# EAGLE schematic Badge (EAGLE 9.4.2)

## Sheet 1 of 8
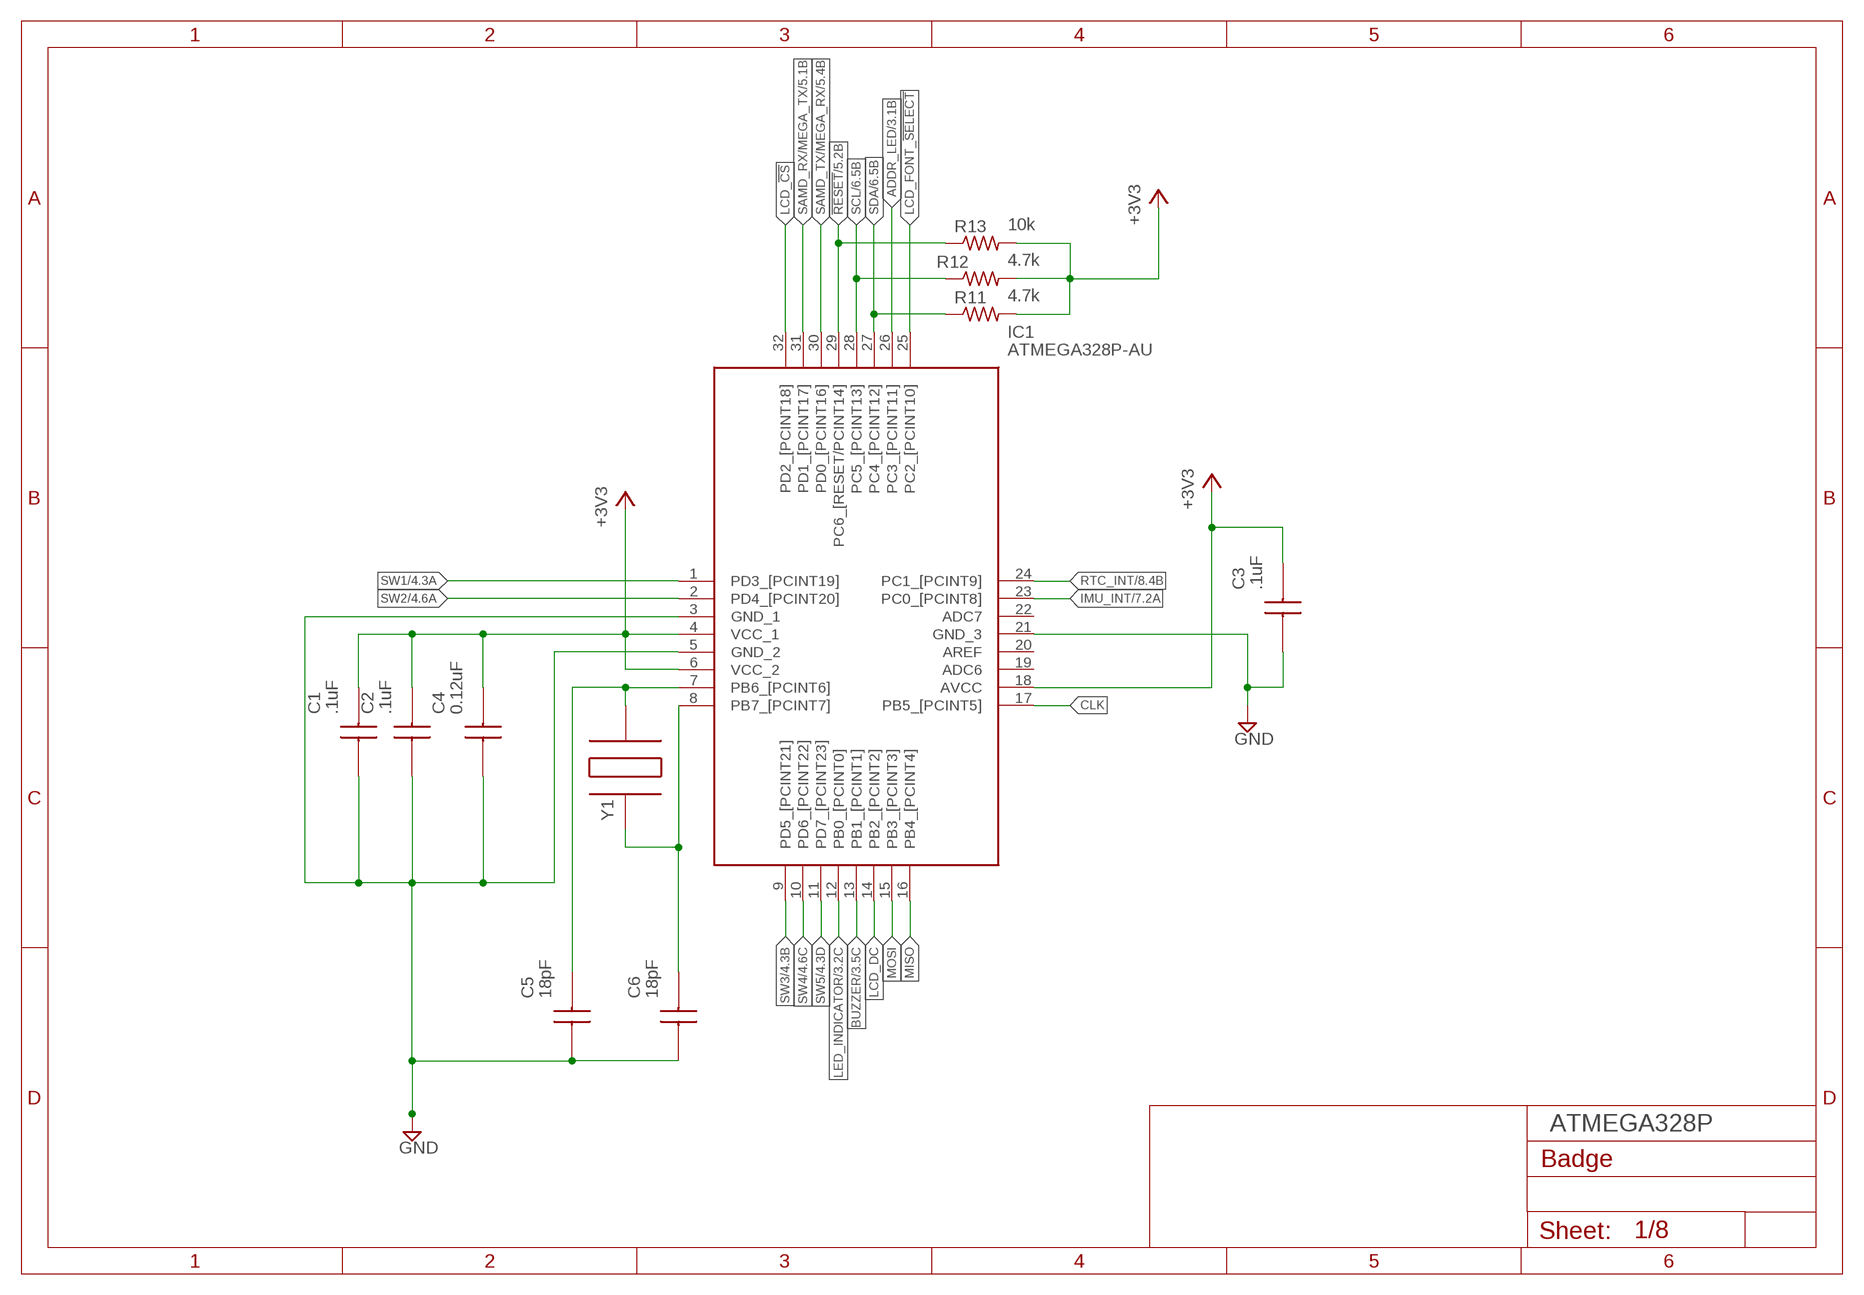
[diagram p0: schematic, sheet 1]

### Parts
C1  .1uF  C06030.1UF  [CAPC1608X87N]
C2  .1uF  C06030.1UF  [CAPC1608X87N]
C3  .1uF  C06030.1UF  [CAPC1608X87N]
C4  0.12uF  C0805  [CAPC2013X94N]
C5  18pF  C0603  [CAPC1608X87N]
C6  18pF  C0603  [CAPC1608X87N]
IC1  ATMEGA328P-AU  [QFP80P900X900X120-32N]
R11  4.7k  R-US_R0603  [R0603]
R12  4.7k  R-US_R0603  [R0603]
R13  10k  R-US_R0603  [R0603]
Y1  ABM3-16.000MHZ-B2-T  [ABM-3]

### Nets
!RESET!: IC1.29(PC6_[RESET/PCINT14]) R13.1 ; also sheet 5
+3V3: C1.2 C2.2 C3.2 C4.2(C2) IC1.4(VCC_1) IC1.6(VCC_2) IC1.18(AVCC) R11.2 R12.2 R13.2 ; also sheet 2,4,5,6,7,8
ADDR_LED: IC1.26(PC3_[PCINT11]) ; also sheet 3
BUZZER: IC1.13(PB1_[PCINT1]) ; also sheet 3
CLK: IC1.17(PB5_[PCINT5])
GND: C1.1 C2.1 C3.1 C4.1(C1) C5.1 C6.1 IC1.3(GND_1) IC1.5(GND_2) IC1.21(GND_3) ; also sheet 2,3,4,5,6,7,8
IMU_INT: IC1.23(PC0_[PCINT8]) ; also sheet 7
LCD_!CS!: IC1.32(PD2_[PCINT18])
LCD_DC: IC1.14(PB2_[PCINT2])
LCD_FONT_!SELECT!: IC1.25(PC2_[PCINT10])
LED_INDICATOR: IC1.12(PB0_[PCINT0]) ; also sheet 3
MISO: IC1.16(PB4_[PCINT4])
MOSI: IC1.15(PB3_[PCINT3])
N$1: C5.2 IC1.7(PB6_[PCINT6]) Y1.2
N$2: C6.2 IC1.8(PB7_[PCINT7]) Y1.1
RTC_INT: IC1.24(PC1_[PCINT9]) ; also sheet 8
SAMD_RX/MEGA_TX: IC1.31(PD1_[PCINT17]) ; also sheet 5
SAMD_TX/MEGA_RX: IC1.30(PD0_[PCINT16]) ; also sheet 5
SCL: IC1.28(PC5_[PCINT13]) R12.1 ; also sheet 6,7,8
SDA: IC1.27(PC4_[PCINT12]) R11.1 ; also sheet 6,7,8
SW1: IC1.1(PD3_[PCINT19]) ; also sheet 4
SW2: IC1.2(PD4_[PCINT20]) ; also sheet 4
SW3: IC1.9(PD5_[PCINT21]) ; also sheet 4
SW4: IC1.10(PD6_[PCINT22]) ; also sheet 4
SW5: IC1.11(PD7_[PCINT23]) ; also sheet 4
Unconnected: IC1.19(ADC6) IC1.20(AREF) IC1.22(ADC7)

### Notes on the sheet
- ATMEGA328P

## Sheet 2 of 8
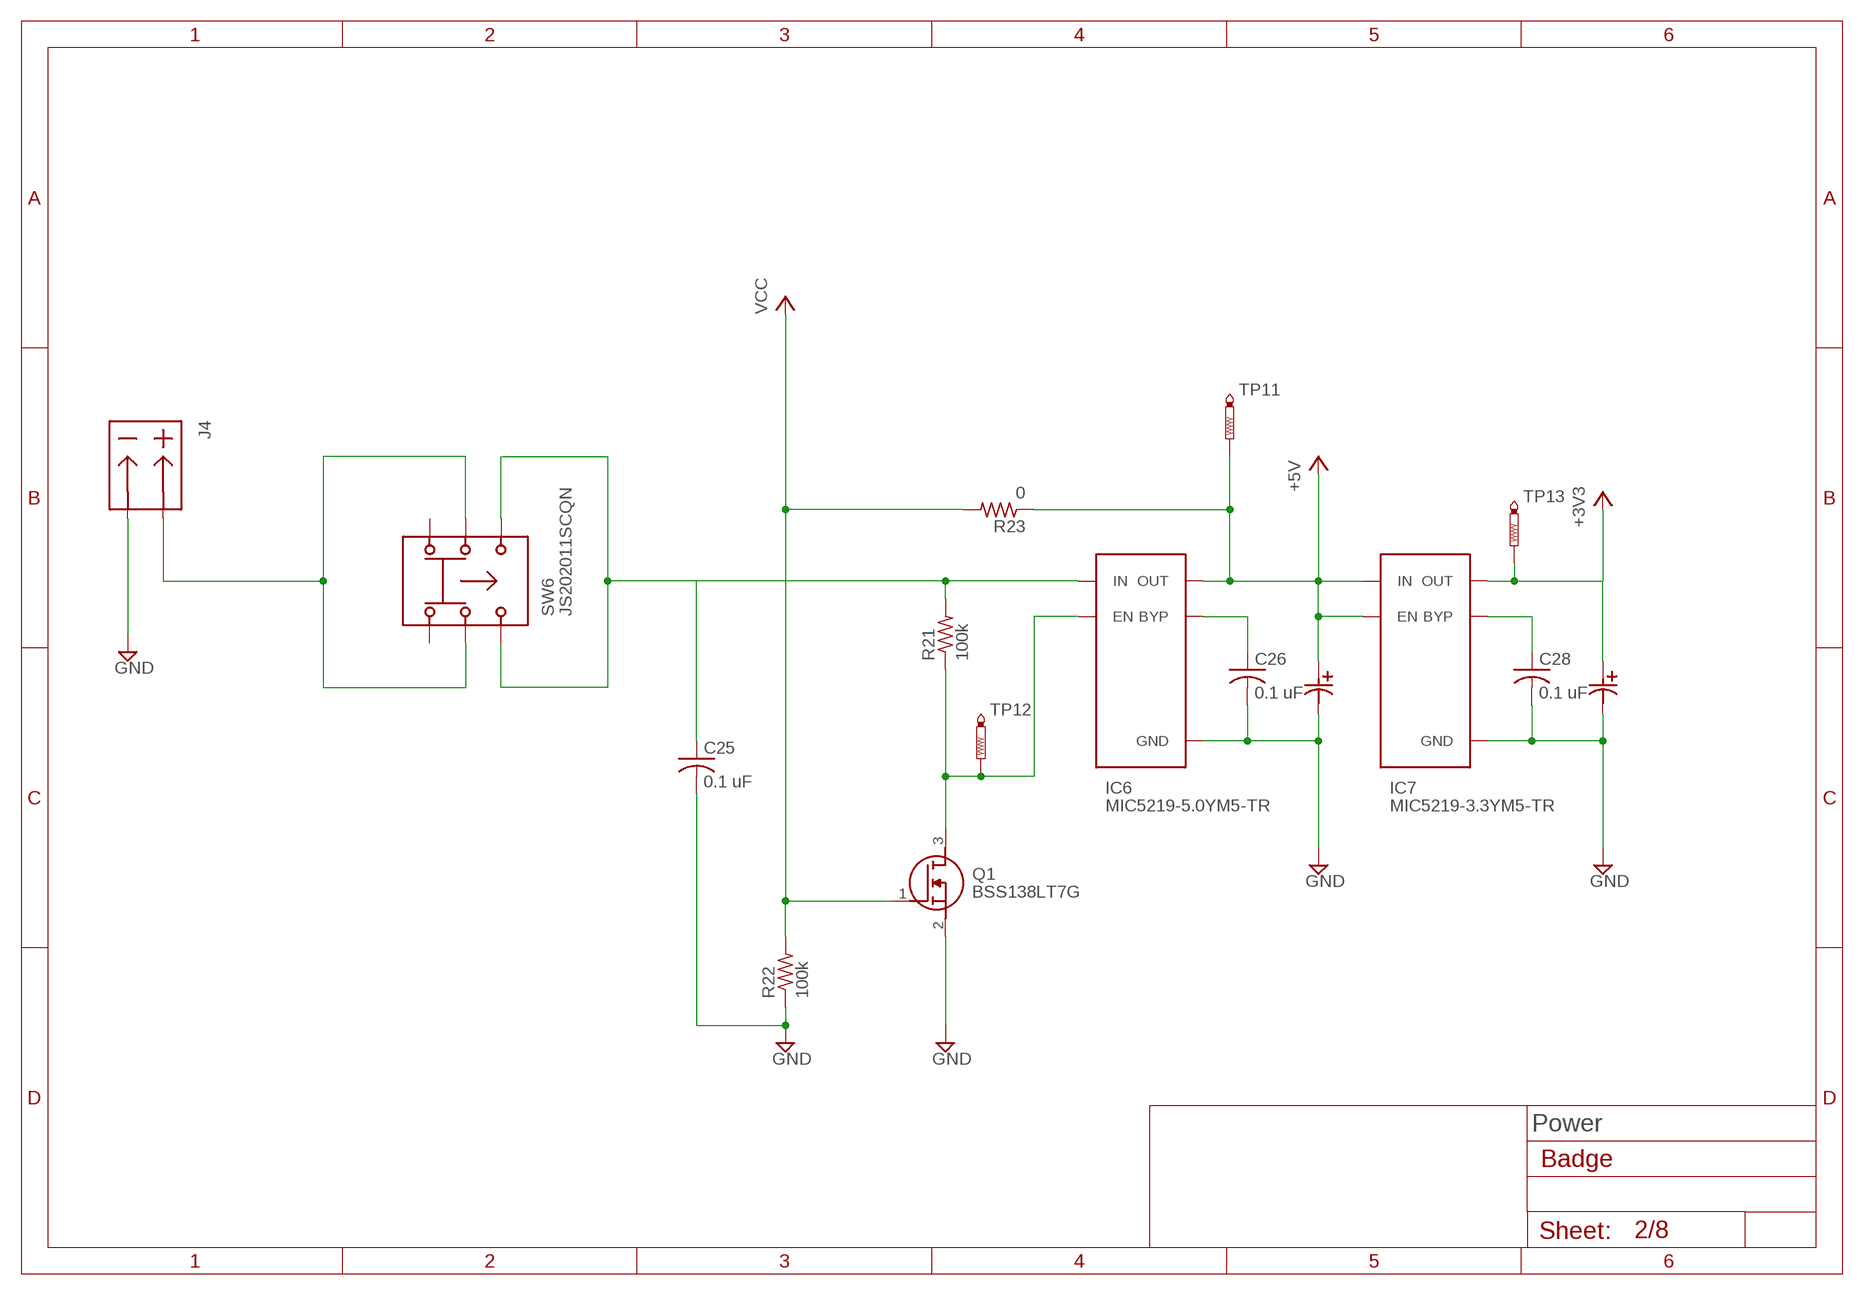
[diagram p1: schematic, sheet 2]

### Parts
C25  0.1 uF  C-USC0603K  [C0603K]
C26  0.1 uF  C-USC0603K  [C0603K]
C27  22uF 16V 4.3mm  22_UF_16V_4.3MM  [CAPAE430X550L180X65N]
C28  0.1 uF  C-USC0603K  [C0603K]
C29  22uF 16V 4.3mm  22_UF_16V_4.3MM  [CAPAE430X550L180X65N]
IC6  MIC5219-5.0YM5-TR  [SOT23-5P95_280X145L45X37N]
IC7  MIC5219-3.3YM5-TR  [SOT23-5P95_280X145L45X37N]
J4  DNP  BAT_CONNECTOR  [BATIN]
Q1  BSS138LT7G  [SOT96P237X111-3N]
R21  100k  R-US_R0603  [R0603]
R22  100k  R-US_R0603  [R0603]
R23  0  R-US_R0603  [R0603]
SW6  JS202011SCQN  [JS202011SCQN]
TP11  PTR1PAD1-20  [P1-20]
TP12  PTR1PAD1-20  [P1-20]
TP13  PTR1PAD1-20  [P1-20]

### Nets
+5V: C27.1(PLUS) IC6.5(OUT) IC7.1(IN) IC7.3(EN) R23.1 TP11.TP ; also sheet 3
+5V1: C29.1(PLUS) IC7.5(OUT) TP13.TP
GND: C25.2 C26.2 C27.2(MINUS) C28.2 C29.2(MINUS) IC6.2(GND) IC7.2(GND) J4.2 Q1.2(S) R22.1 ; also sheet 1,3,4,5,6,7,8
N$5: C26.1 IC6.4(BYP)
N$11: C28.1 IC7.4(BYP)
N$18: J4.1 SW6.2 SW6.5
N$27: C25.1 IC6.1(IN) R21.2 SW6.3 SW6.6
N$28: IC6.3(EN) Q1.3(D) R21.1 TP12.TP
VCC: Q1.1(G) R22.2 R23.2
Unconnected: SW6.1 SW6.4

### Notes on the sheet
- Power

## Sheet 3 of 8
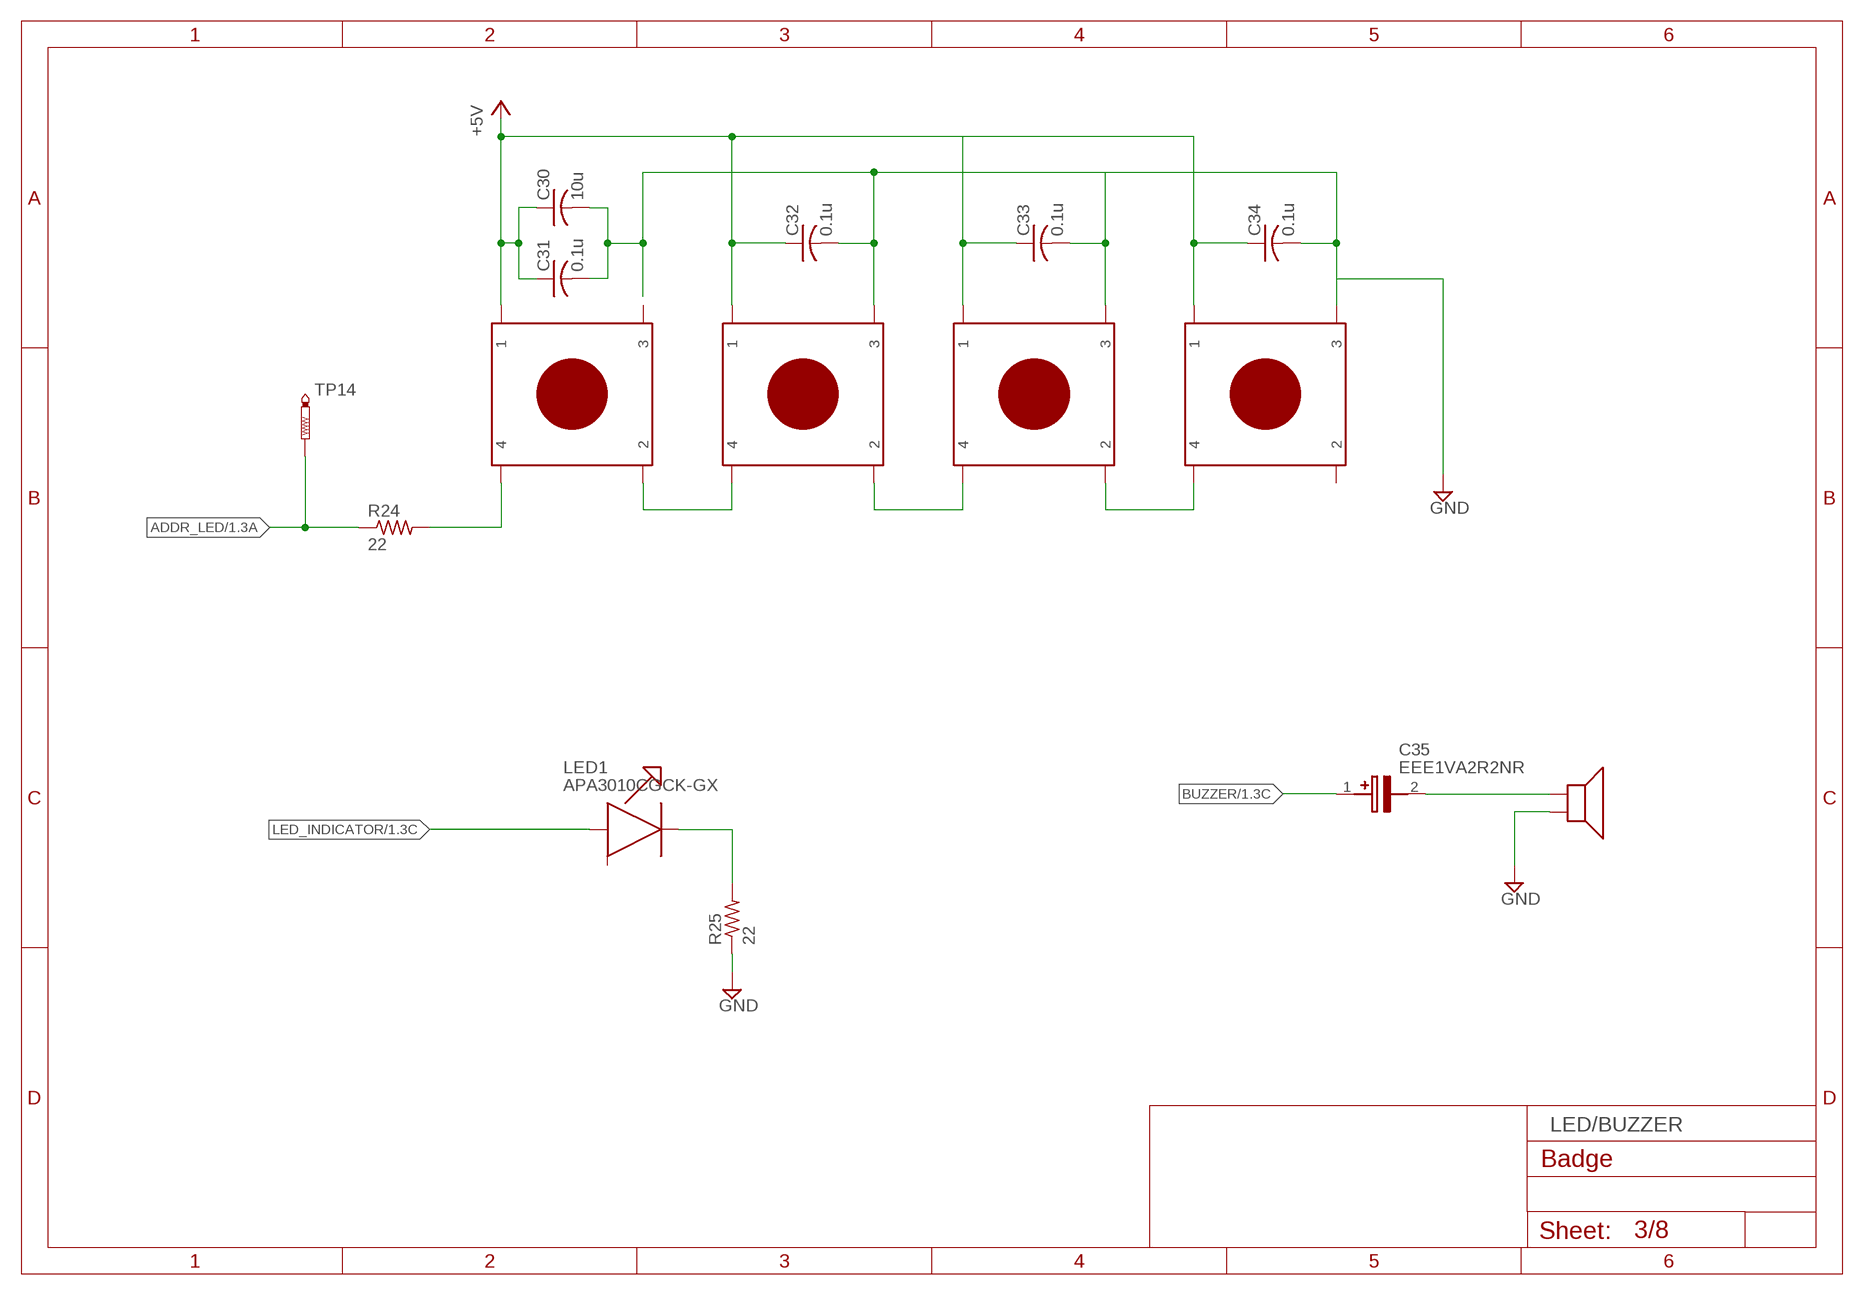
[diagram p2: schematic, sheet 3]

### Parts
C30  10u  C-USC0805K  [C0805K]
C31  0.1u  C-USC0603K  [C0603K]
C32  0.1u  C-USC0603K  [C0603K]
C33  0.1u  C-USC0603K  [C0603K]
C34  0.1u  C-USC0603K  [C0603K]
C35  EEE1VA2R2NR  [CAPAE430X550N]
D2  WS2812B  [WS2812B]
D3  WS2812B  [WS2812B]
D4  WS2812B  [WS2812B]
D5  WS2812B  [WS2812B]
LED1  APA3010CGCK-GX  [APA3010ZGCGX]
LS1  AST-03008MR-R  [PUIAUDIO_AST-03008MR-R]
R24  22  R-US_R0603  [R0603]
R25  22  R-US_R0603  [R0603]
TP14  PTR1PAD1-20  [P1-20]

### Nets
+5V: C30.1 C31.1 C32.1 C33.1 C34.1 D2.1 D3.1 D4.1 D5.1 ; also sheet 2
ADDR_LED: R24.1 TP14.TP ; also sheet 1
BUZZER: C35.1(+) ; also sheet 1
GND: C30.2 C31.2 C32.2 C33.2 C34.2 D3.3 D4.3 D5.3 LS1.2 R25.1 ; also sheet 1,2,4,5,6,7,8
LED_INDICATOR: LED1.2(A) ; also sheet 1
N$10: C35.2(-) LS1.1
N$12: LED1.1(K) R25.2
N$15: D2.2 D3.4
N$25: D3.2 D4.4
N$26: D4.2 D5.4
N$29: D2.4 R24.2
Unconnected: D2.3 D5.2 LED1.3(THERMAL_PAD)

### Notes on the sheet
- LED/BUZZER

## Sheet 4 of 8
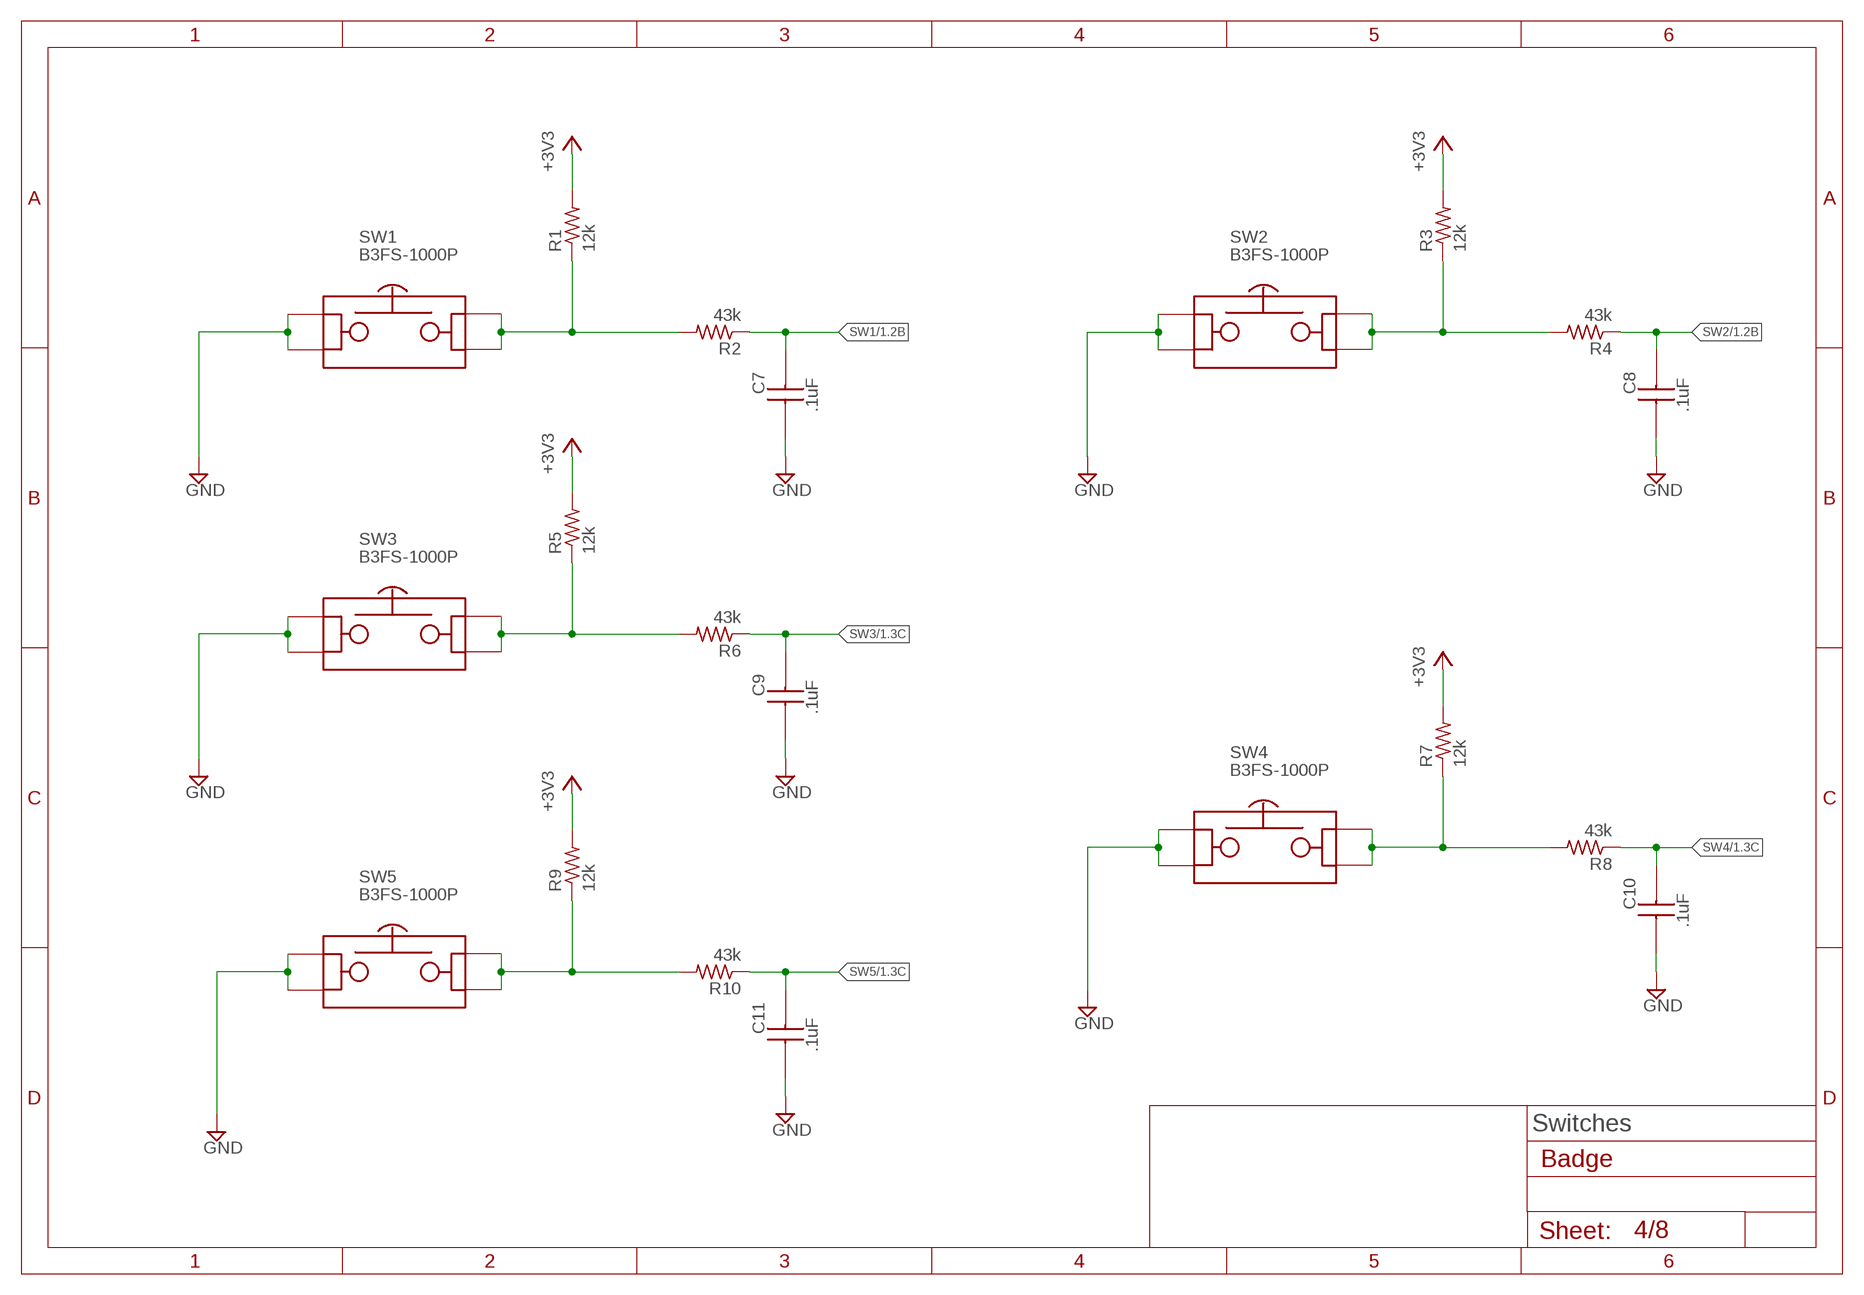
[diagram p3: schematic, sheet 4]

### Parts
C7  .1uF  C06030.1UF  [CAPC1608X87N]
C8  .1uF  C06030.1UF  [CAPC1608X87N]
C9  .1uF  C06030.1UF  [CAPC1608X87N]
C10  .1uF  C06030.1UF  [CAPC1608X87N]
C11  .1uF  C06030.1UF  [CAPC1608X87N]
R1  12k  R-US_R0603  [R0603]
R2  43k  R-US_R0603  [R0603]
R3  12k  R-US_R0603  [R0603]
R4  43k  R-US_R0603  [R0603]
R5  12k  R-US_R0603  [R0603]
R6  43k  R-US_R0603  [R0603]
R7  12k  R-US_R0603  [R0603]
R8  43k  R-US_R0603  [R0603]
R9  12k  R-US_R0603  [R0603]
R10  43k  R-US_R0603  [R0603]
SW1  B3FS-1000P  [B3FS-1000P]
SW2  B3FS-1000P  [B3FS-1000P]
SW3  B3FS-1000P  [B3FS-1000P]
SW4  B3FS-1000P  [B3FS-1000P]
SW5  B3FS-1000P  [B3FS-1000P]

### Nets
+3V3: R1.2 R3.2 R5.2 R7.2 R9.2 ; also sheet 1,2,5,6,7,8
GND: C7.1 C8.1 C9.1 C10.1 C11.1 SW1.P$1 SW1.P$2 SW2.P$1 SW2.P$2 SW3.P$1 SW3.P$2 SW4.P$1 SW4.P$2 SW5.P$1 SW5.P$2 ; also sheet 1,2,3,5,6,7,8
N$4: R1.1 R2.2 SW1.P$3 SW1.P$4
N$6: R5.1 R6.2 SW3.P$3 SW3.P$4
N$7: R7.1 R8.2 SW4.P$3 SW4.P$4
N$8: R3.1 R4.2 SW2.P$3 SW2.P$4
N$14: R9.1 R10.2 SW5.P$3 SW5.P$4
SW1: C7.2 R2.1 ; also sheet 1
SW2: C8.2 R4.1 ; also sheet 1
SW3: C9.2 R6.1 ; also sheet 1
SW4: C10.2 R8.1 ; also sheet 1
SW5: C11.2 R10.1 ; also sheet 1

### Notes on the sheet
- Switches

## Sheet 5 of 8
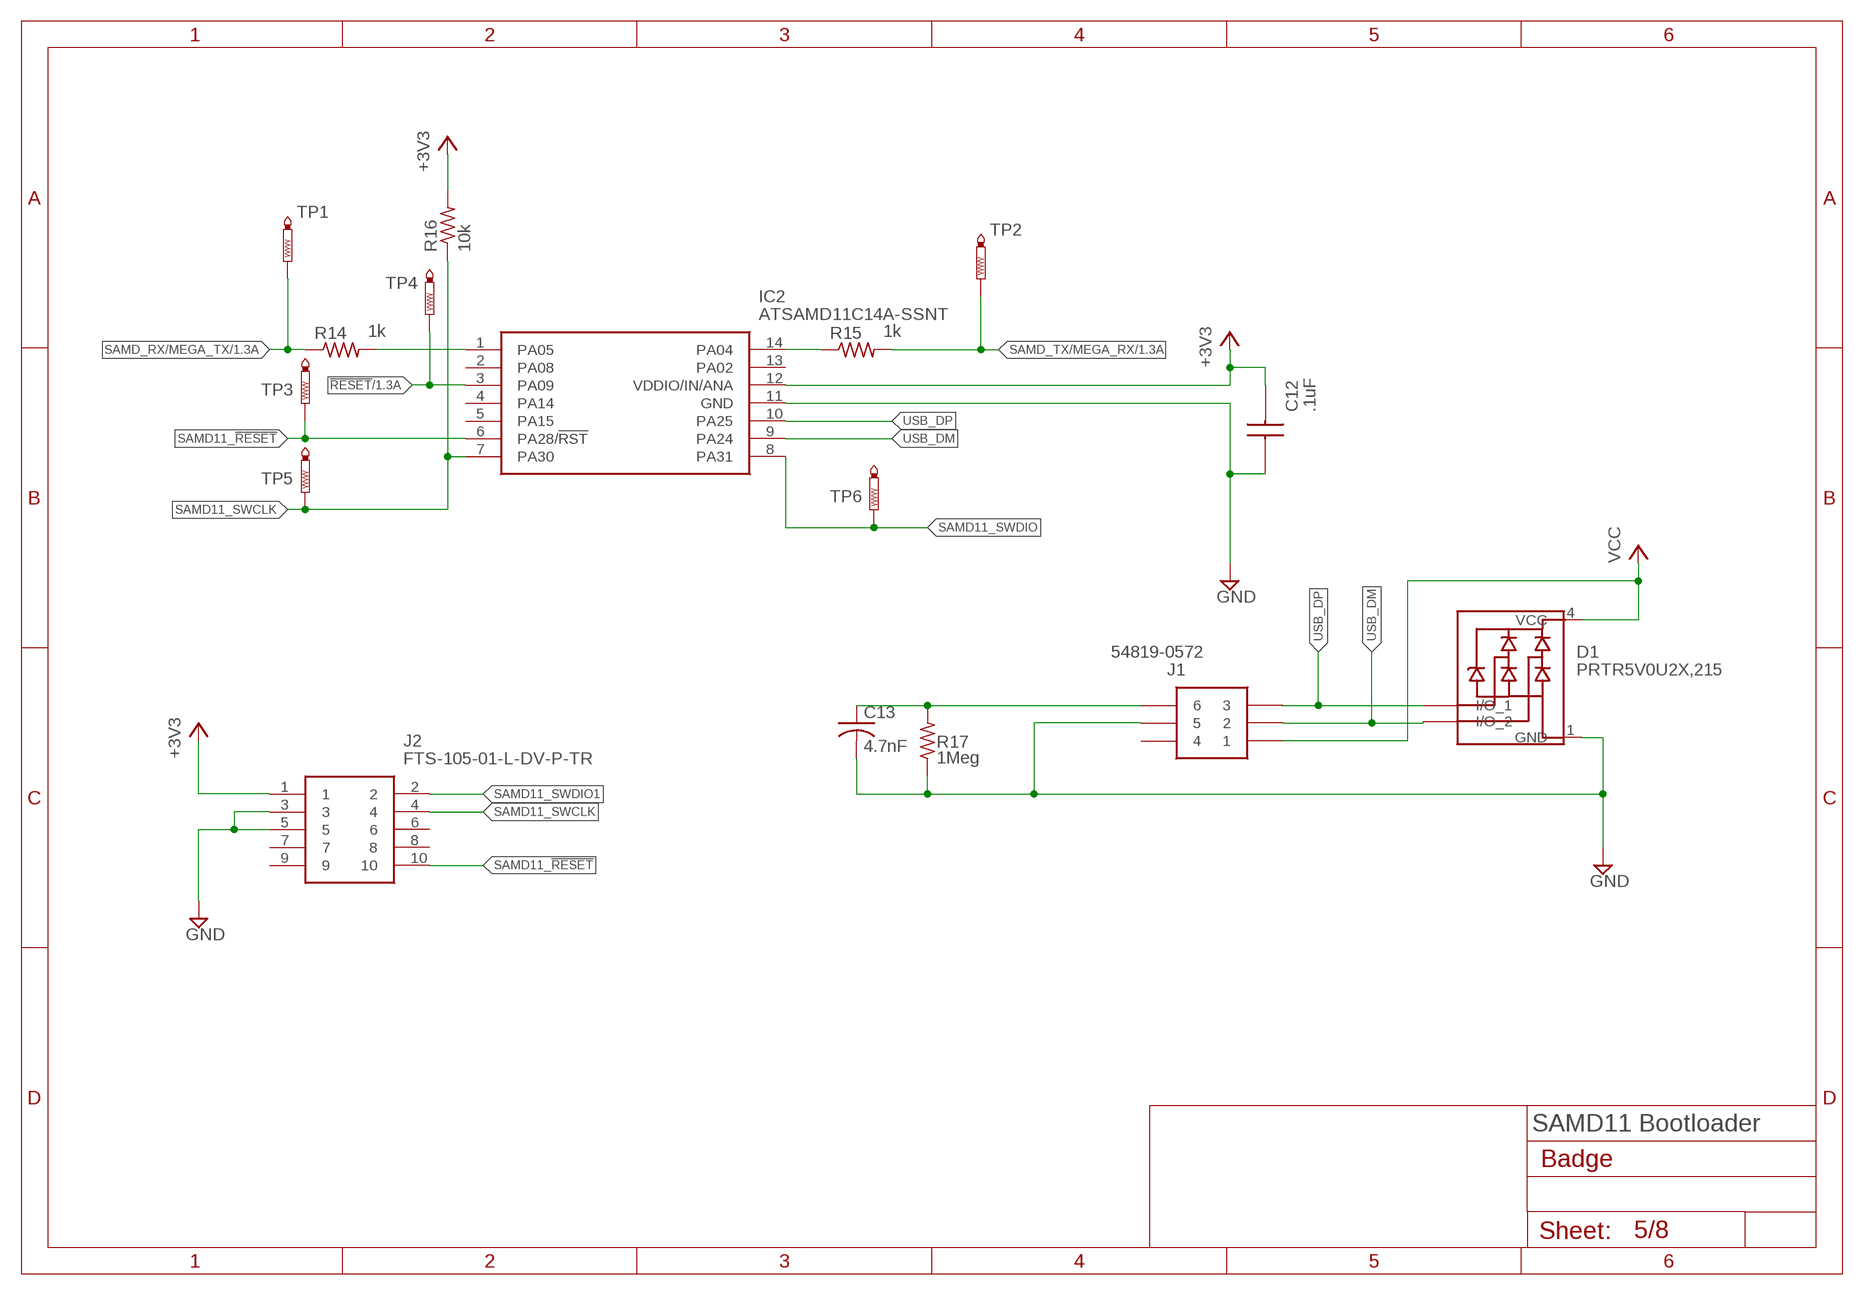
[diagram p4: schematic, sheet 5]

### Parts
C12  .1uF  C06030.1UF  [CAPC1608X87N]
C13  4.7nF  C-USC0805K  [C0805K]
D1  PRTR5V0U2X,215  [SOT-143B]
IC2  ATSAMD11C14A-SSNT  [SOIC127P600X175-14N]
J1  54819-0572  [MOLEXMINIBTYPEB_1]
J2  FTS-105-01-L-DV-P-TR  [FTS10501LDVPTR]
R14  1k  R-US_R0603  [R0603]
R15  1k  R-US_R0603  [R0603]
R16  10k  R-US_R0603  [R0603]
R17  1Meg  R-US_R0603  [R0603]
TP1  PTR1PAD1-20  [P1-20]
TP2  PTR1PAD1-20  [P1-20]
TP3  PTR1PAD1-20  [P1-20]
TP4  PTR1PAD1-20  [P1-20]
TP5  PTR1PAD1-20  [P1-20]
TP6  PTR1PAD1-20  [P1-20]

### Nets
!RESET!: IC2.3(PA09) TP4.TP ; also sheet 1
+3V3: C12.2 IC2.12(VDDIO/IN/ANA) J2.1 R16.2 ; also sheet 1,2,4,6,7,8
GND: C12.1 C13.2 D1.1(GND) IC2.11(GND) J1.5 J2.3 J2.5 R17.1 ; also sheet 1,2,3,4,6,7,8
N$3: IC2.14(PA04) R15.1
N$9: IC2.1(PA05) R14.2
N$13: C13.1 J1.6 J1.7 J1.8 J1.9 R17.2
SAMD11_!RESET!: IC2.6(PA28/!RST) J2.10 TP3.TP
SAMD11_SWCLK: IC2.7(PA30) J2.4 R16.1 TP5.TP
SAMD11_SWDIO: IC2.8(PA31) TP6.TP
SAMD11_SWDIO1: J2.2
SAMD_RX/MEGA_TX: R14.1 TP1.TP ; also sheet 1
SAMD_TX/MEGA_RX: R15.2 TP2.TP ; also sheet 1
USB_DM: D1.3(I/O_2) IC2.9(PA24) J1.2
USB_DP: D1.2(I/O_1) IC2.10(PA25) J1.3
V_USB: D1.4(VCC) J1.1 ; supply symbol labelled VCC
Unconnected: IC2.2(PA08) IC2.4(PA14) IC2.5(PA15) IC2.13(PA02) J1.4 J2.6 J2.7 J2.8 J2.9

### Notes on the sheet
- SAMD11 Bootloader

## Sheet 6 of 8
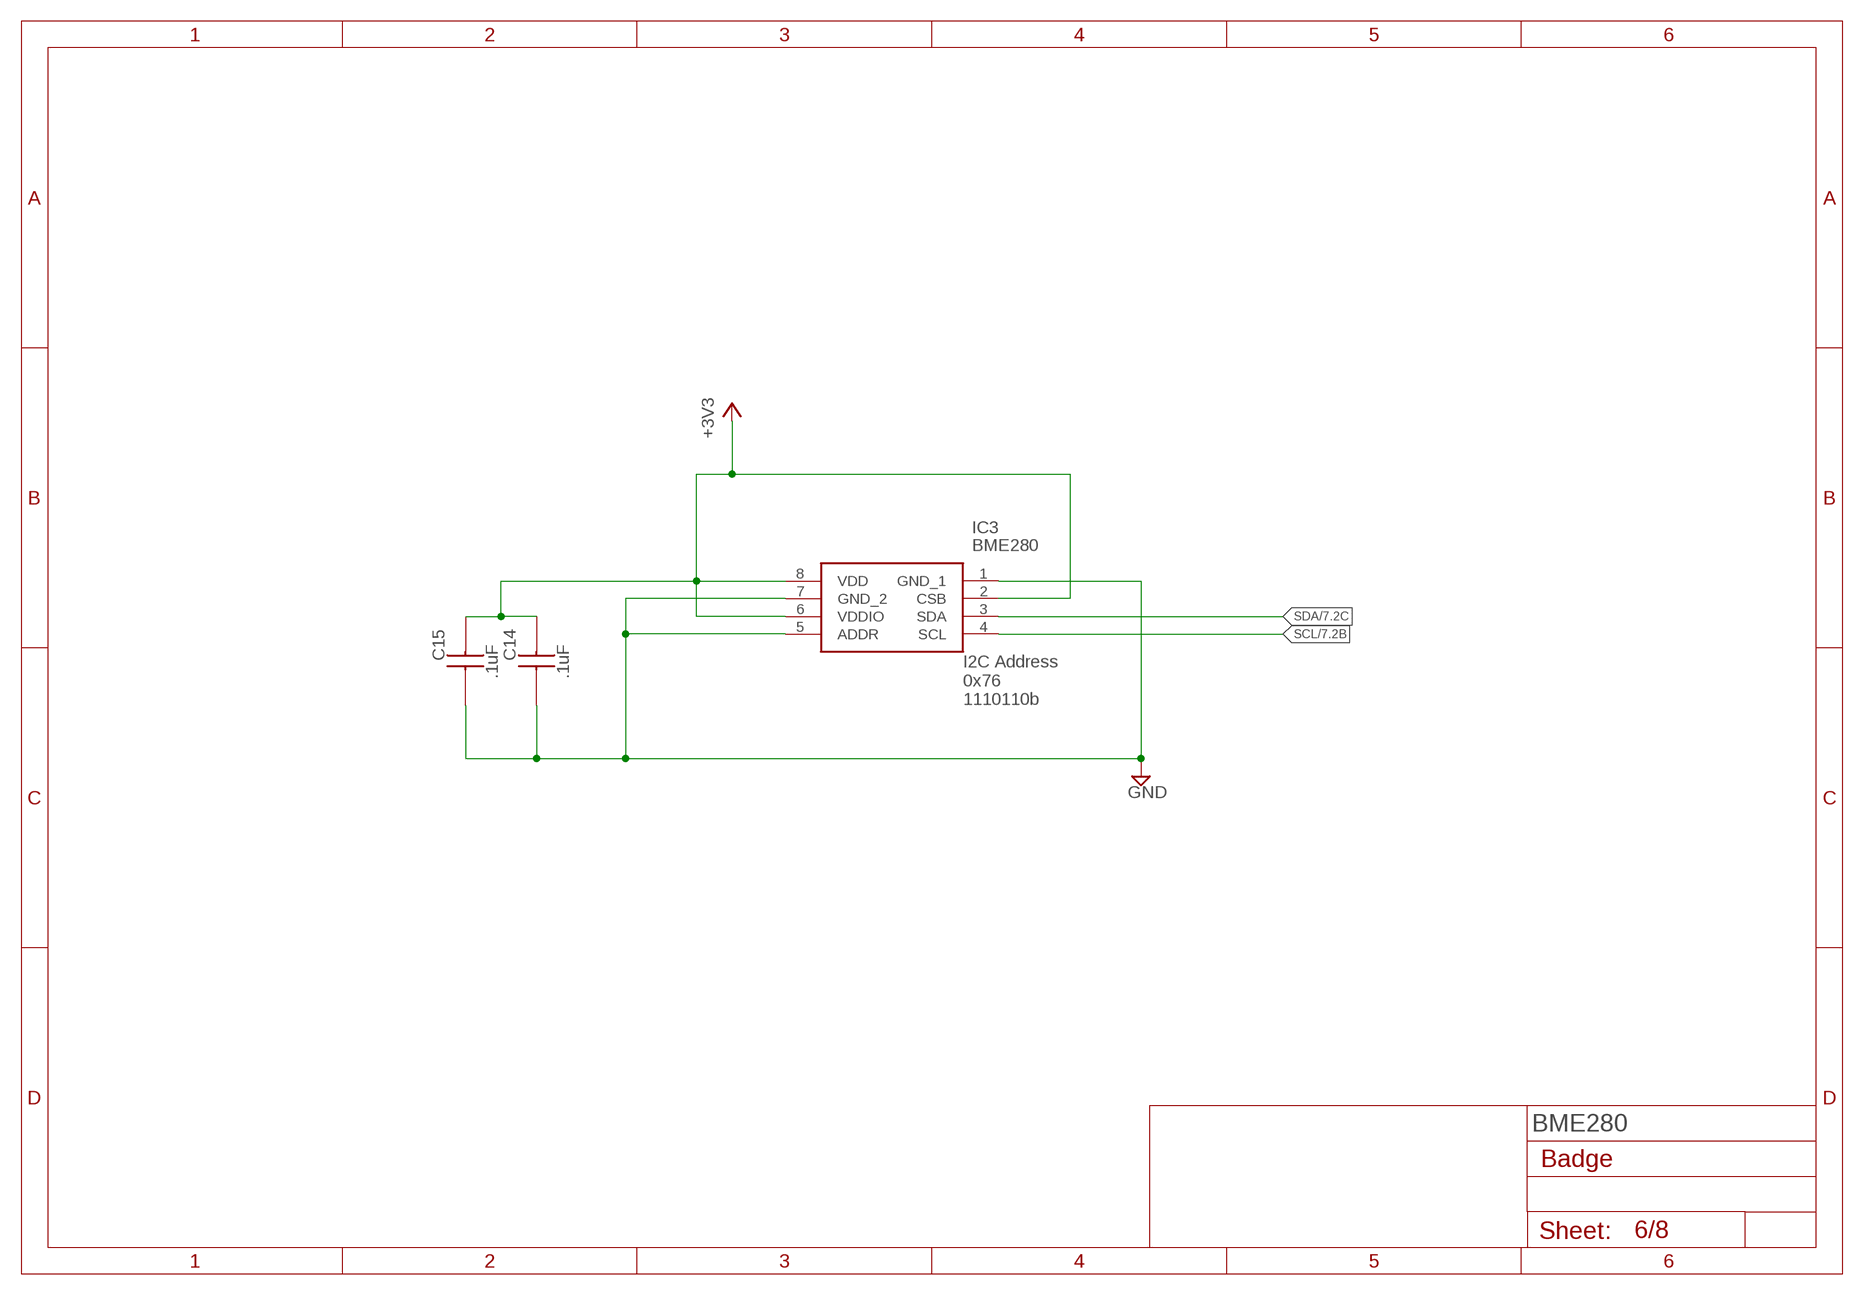
[diagram p5: schematic, sheet 6]

### Parts
C14  .1uF  C06030.1UF  [CAPC1608X87N]
C15  .1uF  C06030.1UF  [CAPC1608X87N]
IC3  BME280  [BME280]

### Nets
+3V3: C14.2 C15.2 IC3.2(CSB) IC3.6(VDDIO) IC3.8(VDD) ; also sheet 1,2,4,5,7,8
GND: C14.1 C15.1 IC3.1(GND_1) IC3.5(ADDR) IC3.7(GND_2) ; also sheet 1,2,3,4,5,7,8
SCL: IC3.4(SCL) ; also sheet 1,7,8
SDA: IC3.3(SDA) ; also sheet 1,7,8

### Notes on the sheet
- I2C Address
  0x76
  1110110b
- BME280

## Sheet 7 of 8
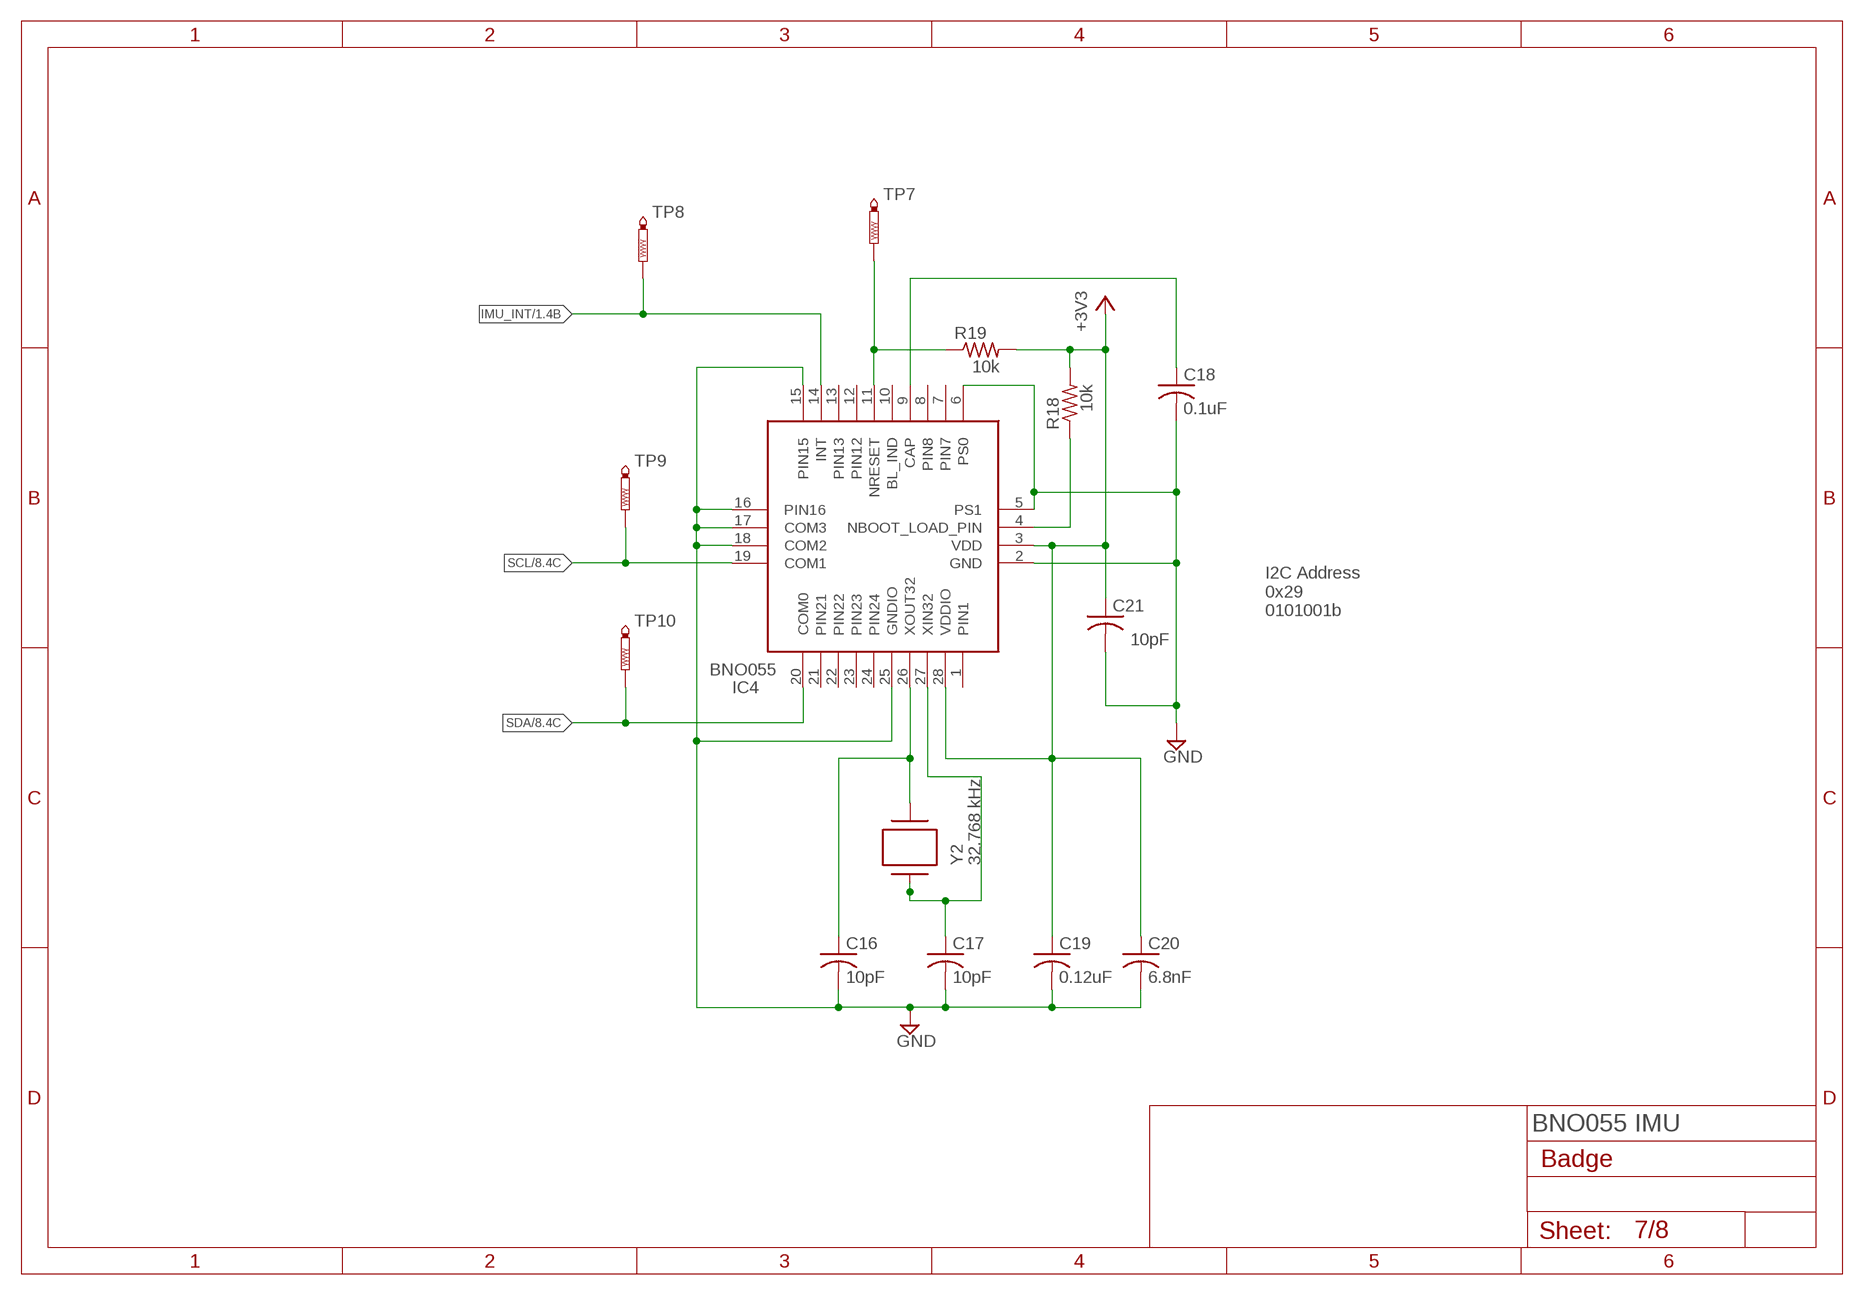
[diagram p6: schematic, sheet 7]

### Parts
C16  10pF  C-USC0603K  [C0603K]
C17  10pF  C-USC0603K  [C0603K]
C18  0.1uF  C-USC0603K  [C0603K]
C19  0.12uF  C-USC0603K  [C0603K]
C20  6.8nF  C-USC0603K  [C0603K]
C21  10pF  C-USC0603K  [C0603K]
IC4  BNO055  [BNO055]
R18  10k  R-US_R0603  [R0603]
R19  10k  R-US_R0603  [R0603]
TP7  PTR1PAD1-20  [P1-20]
TP8  PTR1PAD1-20  [P1-20]
TP9  PTR1PAD1-20  [P1-20]
TP10  PTR1PAD1-20  [P1-20]
Y2  32.768 kHz  MC-405  [XTAL960X406X315]

### Nets
+3V3: C19.1 C20.1 C21.1 IC4.3(VDD) IC4.28(VDDIO) R18.2 R19.2 ; also sheet 1,2,4,5,6,8
GND: C16.2 C17.2 C18.2 C19.2 C20.2 C21.2 IC4.2(GND) IC4.5(PS1) IC4.6(PS0) IC4.15(PIN15) IC4.16(PIN16) IC4.17(COM3) IC4.18(COM2) IC4.25(GNDIO) ; also sheet 1,2,3,4,5,6,8
IMU_INT: IC4.14(INT) TP8.TP ; also sheet 1
N$16: C16.1 IC4.26(XOUT32) Y2.1
N$17: C17.1 IC4.27(XIN32) Y2.2
N$19: C18.1 IC4.9(CAP)
N$20: IC4.4(NBOOT_LOAD_PIN) R18.1
N$21: IC4.11(NRESET) R19.1 TP7.TP
SCL: IC4.19(COM1) TP9.TP ; also sheet 1,6,8
SDA: IC4.20(COM0) TP10.TP ; also sheet 1,6,8
Unconnected: IC4.1(PIN1) IC4.7(PIN7) IC4.8(PIN8) IC4.10(BL_IND) IC4.12(PIN12) IC4.13(PIN13) IC4.21(PIN21) IC4.22(PIN22) IC4.23(PIN23) IC4.24(PIN24)

### Notes on the sheet
- I2C Address
  0x29
  0101001b
- BNO055 IMU

## Sheet 8 of 8
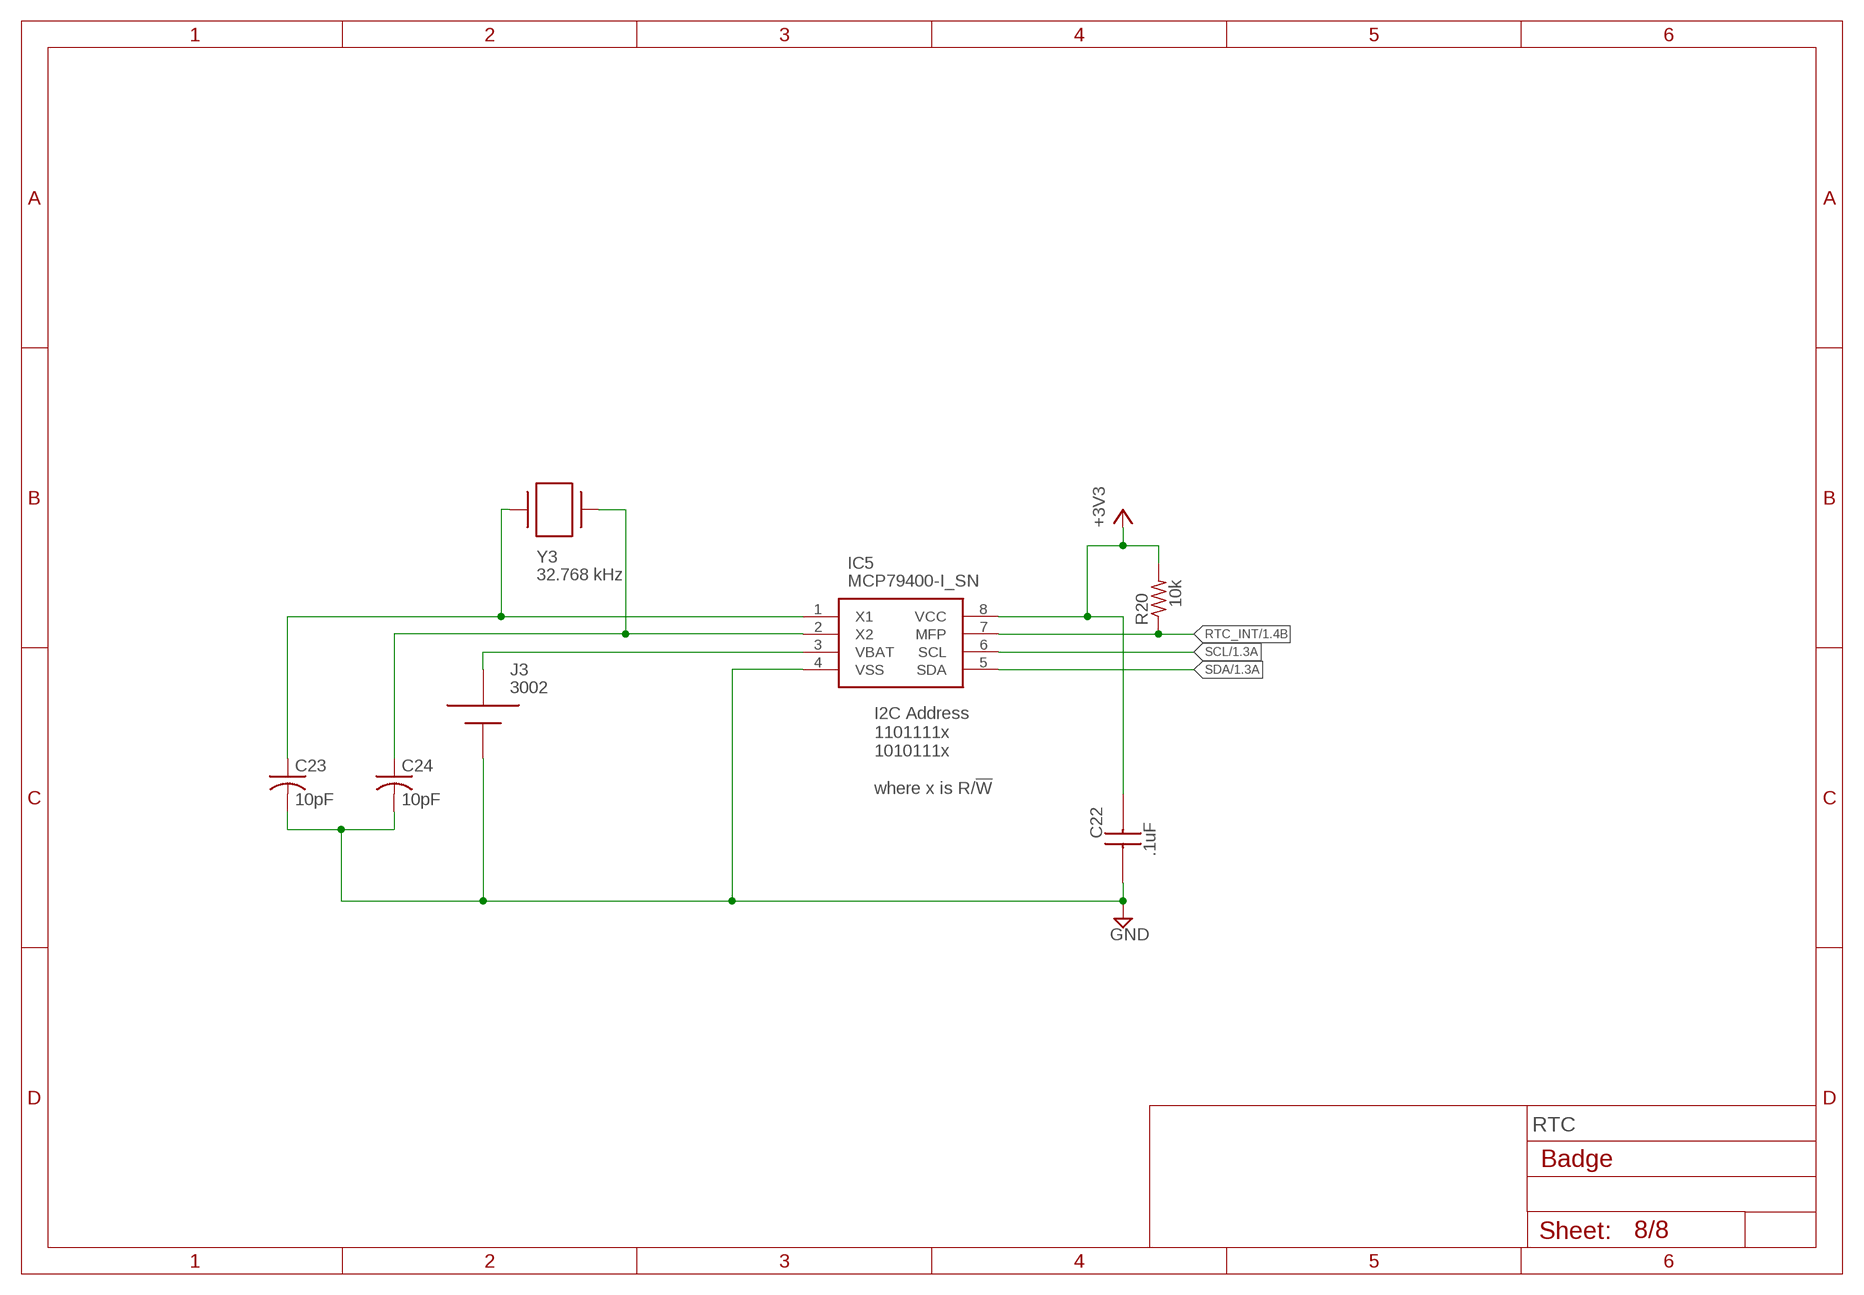
[diagram p7: schematic, sheet 8]

### Parts
C22  .1uF  C06030.1UF  [CAPC1608X87N]
C23  10pF  C-USC0603K  [C0603K]
C24  10pF  C-USC0603K  [C0603K]
IC5  MCP79400-I_SN  [SOIC127P600X175-8N]
J3  3002  [SMT_CELL_HOLDER]
R20  10k  R-US_R0603  [R0603]
Y3  32.768 kHz  MC-405  [XTAL960X406X315]

### Nets
+3V3: C22.2 IC5.8(VCC) R20.2 ; also sheet 1,2,4,5,6,7
GND: C22.1 C23.2 C24.2 IC5.4(VSS) J3.2(NEG) ; also sheet 1,2,3,4,5,6,7
N$22: IC5.3(VBAT) J3.1(POS_1) J3.3(POS_1)
N$23: C23.1 IC5.1(X1) Y3.2
N$24: C24.1 IC5.2(X2) Y3.1
RTC_INT: IC5.7(MFP) R20.1 ; also sheet 1
SCL: IC5.6(SCL) ; also sheet 1,6,7
SDA: IC5.5(SDA) ; also sheet 1,6,7

### Notes on the sheet
- I2C Address
  1101111x
  1010111x
  
  where x is R/!W!
- RTC

## Library data of the parts
C1-C3 C7-C12 C14 C15 C22 = Badge:C0603: Kemet 0603 C 18pF Ceramic Multilayer Capacitor, 50 V dc, +125C, C0G Dielectric, +/-5% Source: Datasheet <http://uk.rs-online.com/web/p/products/0147415>; DESCRIPTION: CAPACITOR, 0603 100nF +/-10% 16V; HEIGHT: 0.87mm; MANUFACTURER_NAME: Yageo; MANUFACTURER_PART_NUMBER: CC0603KRX7R7BB104; MOUSER_PRICE-STOCK: https://www.mouser.com/Search/Refine.aspx?Keyword=603-CC603KRX7R7BB104
C4 = Badge:C0805: Capacitor 0805 0.12UF +/-10% 25V Source: Datasheet; DESCRIPTION: Capacitor 0805 0.12UF +/-10% 25V; HEIGHT: mm; MANUFACTURER_NAME: AVX; MANUFACTURER_PART_NUMBER: 08053C124KAT4A; MOUSER_PART_NUMBER: 581-08053C124KAT4A; MOUSER_PRICE-STOCK: https://www.mouser.com/Search/Refine.aspx?Keyword=581-08053C124KAT4A
C5 C6 = Badge:C0603: Kemet 0603 C 18pF Ceramic Multilayer Capacitor, 50 V dc, +125C, C0G Dielectric, +/-5% Source: Datasheet <http://uk.rs-online.com/web/p/products/0147415>; DESCRIPTION: Kemet 0603 C 18pF Ceramic Multilayer Capacitor, 50 V dc, +125C, C0G Dielectric, +/-5%; HEIGHT: 0.87mm; MANUFACTURER_NAME: Kemet; MANUFACTURER_PART_NUMBER: C0603C180J5GACTU; MOUSER_PART_NUMBER: 80-C0603C180J5G; MOUSER_PRICE-STOCK: https://www.mouser.com/Search/Refine.aspx?Keyword=80-C0603C180J5G; RS_PART_NUMBER: 0147415P; RS_PRICE-STOCK: http://uk.rs-online.com/web/p/products/0147415P
C13 C16-C21 C23-C26 C28 C30-C34 = rcl:C-US: CAPACITOR, American symbol; SPICEPREFIX: C
C27 C29 = Badge_v202004081200_Eagle_Library_regex:22_UF_16V_4.3MM; DATASHEET: EDK226M016A9BAA; MANUFACTURER: KEMET EDK226M016A9BAA
C35 = SamacSys_Parts:EEE1VA2R2NR: PANASONIC - EEE-1VA2R2NR - ALUMINUM ELECTROLYTIC CAPACITOR, 2.2UF, 35V, 20%, SMD, FULL REEL Source: Datasheet <https://industrial.panasonic.com/cdbs/www-data/pdf/RDE0000/ABA0000C1145.pdf>; DESCRIPTION: PANASONIC - EEE-1VA2R2NR - ALUMINUM ELECTROLYTIC CAPACITOR, 2.2UF, 35V, 20%, SMD, FULL REEL; HEIGHT: 5.5mm; MANUFACTURER_NAME: Panasonic; MANUFACTURER_PART_NUMBER: EEE1VA2R2NR
D1 = SamacSys_Parts:PRTR5V0U2X,215: ESD Protection Diodes 5.5V Dual SOT143B NXP PRTR5V0U2X,215 Dual Uni-Directional TVS Diode, 4-Pin SOT-143B Source: Datasheet <http://docs-emea.rs-online.com/webdocs/0f75/0900766b80f751d4.pdf>; DESCRIPTION: ESD Protection Diodes 5.5V Dual SOT143B NXP PRTR5V0U2X,215 Dual Uni-Directional TVS Diode, 4-Pin SOT-143B; HEIGHT: mm; MANUFACTURER_NAME: Nexperia; MANUFACTURER_PART_NUMBER: PRTR5V0U2X,215; MOUSER_PART_NUMBER: 771-PRTR5V0U2X-T/R; MOUSER_PRICE-STOCK: https://www.mouser.com/Search/Refine.aspx?Keyword=771-PRTR5V0U2X-T%2FR; RS_PART_NUMBER: 7258720P; RS_PRICE-STOCK: http://uk.rs-online.com/web/p/products/7258720P
D2-D5 = Badge_v202004081200_Eagle_Library_regex:WS2812B; DATASHEET: https://cdn-shop.adafruit.com/datasheets/WS2812B.pdf
IC1 = Badge:ATMEGA328P-AU: MICROCHIP - ATMEGA328P-AU. - MICROCONTROLLER MCU, 8 BIT, ATMEGA, 20MHZ, TQFP-32 Source: Datasheet <https://componentsearchengine.com/Datasheets/2/ATMEGA328P-AU.pdf>; DESCRIPTION: MICROCHIP - ATMEGA328P-AU. - MICROCONTROLLER MCU, 8 BIT, ATMEGA, 20MHZ, TQFP-32; HEIGHT: 1.2mm; MANUFACTURER_NAME: Microchip; MANUFACTURER_PART_NUMBER: ATMEGA328P-AU; MOUSER_PART_NUMBER: 556-ATMEGA328P-AU; MOUSER_PRICE-STOCK: https://www.mouser.com/Search/Refine.aspx?Keyword=556-ATMEGA328P-AU; RS_PART_NUMBER: 1310271P; RS_PRICE-STOCK: http://uk.rs-online.com/web/p/products/1310271P
IC2 = SamacSys_Parts:ATSAMD11C14A-SSNT: ARM Microcontrollers - MCU 14 SOIC,105C, GREEN,1.6-3.6V,48MHz,USB Source: Datasheet <http://ww1.microchip.com/downloads/en/DeviceDoc/Atmel-42363-SAM-D11_Datasheet.pdf>; DESCRIPTION: ARM Microcontrollers - MCU 14 SOIC,105C, GREEN,1.6-3.6V,48MHz,USB; HEIGHT: 1.75mm; MANUFACTURER_NAME: Microchip; MANUFACTURER_PART_NUMBER: ATSAMD11C14A-SSNT; MOUSER_PART_NUMBER: 556-ATSAMD11C14ASSNT; MOUSER_PRICE-STOCK: https://www.mouser.com/Search/Refine.aspx?Keyword=556-ATSAMD11C14ASSNT
IC3 = SamacSys_Parts:BME280: Board Mount Humidity Sensors Source: Datasheet <http://ae-bst.resource.bosch.com/media/products/dokumente/bme280/BST-BME280_DS001-11.pdf>; DESCRIPTION: Board Mount Humidity Sensors; HEIGHT: mm; MANUFACTURER_NAME: Bosch Sensortec; MANUFACTURER_PART_NUMBER: BME280; MOUSER_PART_NUMBER: 262-BME280; MOUSER_PRICE-STOCK: https://www.mouser.com/Search/Refine.aspx?Keyword=262-BME280
IC4 = SamacSys_Parts:BNO055: IMUs - Inertial Measurement Units Absolute Orientation 9-Axis Sensor Source: Datasheet <https://ae-bst.resource.bosch.com/media/_tech/media/datasheets/BST_BNO055_DS000_14.pdf>; DESCRIPTION: IMUs - Inertial Measurement Units Absolute Orientation 9-Axis Sensor; HEIGHT: 1mm; MANUFACTURER_NAME: Bosch Sensortec; MANUFACTURER_PART_NUMBER: BNO055; MOUSER_PART_NUMBER: 262-BNO055; MOUSER_PRICE-STOCK: https://www.mouser.com/Search/Refine.aspx?Keyword=262-BNO055
IC5 = SamacSys_Parts:MCP79400-I_SN: Microchip MCP79400-I/SN, Real Time Clock (RTC), 64B RAM Serial-2 Wire, Serial-I2C, 8-Pin SOIC Source: Datasheet <http://ww1.microchip.com/downloads/en/DeviceDoc/20005009F.pdf>; ALLIED_NUMBER: 70451441; ALLIED_PRICE-STOCK: https://www.alliedelec.com/microchiptechnologyinc-mcp79400-i-sn/70451441/; DESCRIPTION: Microchip MCP79400-I/SN, Real Time Clock (RTC), 64B RAM Serial-2 Wire, Serial-I2C, 8-Pin SOIC; HEIGHT: 1.75mm; MANUFACTURER_NAME: Microchip; MANUFACTURER_PART_NUMBER: MCP79400-I/SN; MOUSER_PART_NUMBER: 579-MCP79400ISN; MOUSER_PRICE-STOCK: https://www.mouser.com/Search/Refine.aspx?Keyword=579-MCP79400ISN; RS_PART_NUMBER: 8230776P; RS_PRICE-STOCK: http://uk.rs-online.com/web/p/products/8230776P
IC6 = Badge_v202004081200_Eagle_Library_regex:MIC5219-5.0YM5-TR; DATASHEET: http://datasheets.diptrace.com/microchip/mic5219.pdf; MANUFACTURER: Microchip
IC7 = Badge_v202004081200_Eagle_Library_regex:MIC5219-3.3YM5-TR; DATASHEET: http://datasheets.diptrace.com/microchip/mic5219.pdf; MANUFACTURER: Microchip
J1 = SamacSys_Parts:54819-0572: Surface mount onthego connector,1A 30V Molex On-The-Go Series Right Angle SMT Version 2.0 Type B Mini USB Connector Receptacle, 30 V, 1A Source: Datasheet <http://www.molex.com/webdocs/datasheets/pdf/en-us/0548190572_IO_CONNECTORS.pdf>; ALLIED_NUMBER: 70266924; ALLIED_PRICE-STOCK: http://www.alliedelec.com/molex-incorporated-54819-0572/70266924/; DESCRIPTION: Surface mount onthego connector,1A 30V Molex On-The-Go Series Right Angle SMT Version 2.0 Type B Mini USB Connector Receptacle, 30 V, 1A; HEIGHT: mm; MANUFACTURER_NAME: Molex; MANUFACTURER_PART_NUMBER: 54819-0572; MOUSER_PART_NUMBER: 538-54819-0572; MOUSER_PRICE-STOCK: https://www.mouser.com/Search/Refine.aspx?Keyword=538-54819-0572; RS_PART_NUMBER: 5151995P; RS_PRICE-STOCK: http://uk.rs-online.com/web/p/products/5151995P
J2 = SamacSys_Parts:FTS-105-01-L-DV-P-TR: Samtec FTS, 10 Way, 2 Row, Vertical PCB Header Source: Datasheet <http://suddendocs.samtec.com/prints/fts-1xx-xx-xx-xx-xx-mkt.pdf>; DESCRIPTION: Samtec FTS, 10 Way, 2 Row, Vertical PCB Header; HEIGHT: 3.91mm; MANUFACTURER_NAME: SAMTEC; MANUFACTURER_PART_NUMBER: FTS-105-01-L-DV-P-TR; MOUSER_PART_NUMBER: 200-FTS10501LDVPTR; MOUSER_PRICE-STOCK: https://www.mouser.com/Search/Refine.aspx?Keyword=200-FTS10501LDVPTR; RS_PART_NUMBER: 1801902P; RS_PRICE-STOCK: http://uk.rs-online.com/web/p/products/1801902P
J3 = SamacSys_Parts:3002: SMT Holder for 20mm Cell-Tin Nickel Plate P/N 3002 Source: Datasheet <http://www.keyelco.com/product.cfm/product_id/779>; ALLIED_NUMBER: 70181637; ALLIED_PRICE-STOCK: http://www.alliedelec.com/keystone-electronics-3002/70181637/; DESCRIPTION: SMT Holder for 20mm Cell-Tin Nickel Plate P/N 3002; HEIGHT: mm; MANUFACTURER_NAME: Keystone Electronics; MANUFACTURER_PART_NUMBER: 3002; MOUSER_PART_NUMBER: 534-3002; MOUSER_PRICE-STOCK: https://www.mouser.com/Search/Refine.aspx?Keyword=534-3002; RS_PART_NUMBER: 2197954; RS_PRICE-STOCK: http://uk.rs-online.com/web/p/products/2197954
J4 = Badge_v202004081200_Eagle_Library_regex:BAT_CONNECTOR
LED1 = SamacSys_Parts:APA3010CGCK-GX: Standard LEDs - SMD RA Grn 570nm 60mcd 120deg Water Clr Source: Datasheet <http://www.kingbrightusa.com/images/catalog/SPEC/APA3010CGCK-GX.pdf>; ALLIED_NUMBER: 71053038; ALLIED_PRICE-STOCK: https://www.alliedelec.com/kingbright-apa3010cgck-gx/71053038/; DESCRIPTION: Standard LEDs - SMD RA Grn 570nm 60mcd 120deg Water Clr; HEIGHT: 2mm; MANUFACTURER_NAME: Kingbright; MANUFACTURER_PART_NUMBER: APA3010CGCK-GX; MOUSER_PART_NUMBER: 604-APA3010CGCK-GX; MOUSER_PRICE-STOCK: https://www.mouser.com/Search/Refine.aspx?Keyword=604-APA3010CGCK-GX
LS1 = Badge_v202004081200_Eagle_Library_regex:AST-03008MR-R; DATASHEET: http://datasheets.diptrace.com/speak_buzz_mic/AST-03008MR-R.pdf; MANUFACTURER: Pui Audio
Q1 = SamacSys_Parts:BSS138LT7G: MOSFET Single N-Channel Logic Level Power MOSFET 50V, 200mA, 3.5 Source: Datasheet <https://www.mouser.com/datasheet/2/308/BSS138LT1-D-1522521.pdf>; DESCRIPTION: MOSFET Single N-Channel Logic Level Power MOSFET 50V, 200mA, 3.5; HEIGHT: 1.11mm; MANUFACTURER_NAME: ON Semiconductor; MANUFACTURER_PART_NUMBER: BSS138LT7G; MOUSER_PART_NUMBER: 863-BSS138LT7G; MOUSER_PRICE-STOCK: https://www.mouser.com/Search/Refine.aspx?Keyword=863-BSS138LT7G
R1 R3 R5 R7 R9 = rcl:R-US_: RESISTOR, American symbol; DESCRIPTION: RES SMD 12K OHM 5% 1/10W 0603; MANUFACTURER_PART_NUMBER: RC0603JR-0712KL; SPICEPREFIX: R
R2 R4 R6 R8 R10 = rcl:R-US_: RESISTOR, American symbol; DESCRIPTION: RES SMD 43K OHM 5% 1/10W 0603; MANUFACTURER_PART_NUMBER: RC0603JR-0743KL; SPICEPREFIX: R
R11 = rcl:R-US_: RESISTOR, American symbol; MANUFACTURER_PART_NUMBER: o RC0603JR-074K7L; SPICEPREFIX: R
R12 R21-R23 = rcl:R-US_: RESISTOR, American symbol; SPICEPREFIX: R
R13-R16 R18-R20 = rcl:R-US_: RESISTOR, American symbol; MANUFACTURER_PART_NUMBER: RC0603JR-0710KL; SPICEPREFIX: R
R17 R24 R25 = Badge:R-US_: RESISTOR, American symbol; SPICEPREFIX: R
SW1-SW5 = Badge:B3FS-1000P; DESCRIPTION: SWITCH TACTILE SPST-NO 0.05A 24V; MANUFACTURER_PART_NUMBER: B3FS-1000P
SW6 = Badge_v202004081200_Eagle_Library_regex:JS202011SCQN; DATASHEET: https://dznh3ojzb2azq.cloudfront.net/products/Slide/JS/documents/datasheet.pdf; MANUFACTURER: C&K
TP1-TP14 = testpad:PTR1: TEST PIN
Y1 = Badge:ABM3-16.000MHZ-B2-T: ABRACON - ABM3-16.000MHZ-B2-T - CRYSTAL, 16MHZ, 18PF CL, 5X3.2MM, SMT Source: Datasheet <https://abracon.com/Resonators/abm3.pdf>; DESCRIPTION: ABRACON - ABM3-16.000MHZ-B2-T - CRYSTAL, 16MHZ, 18PF CL, 5X3.2MM, SMT; HEIGHT: mm; MANUFACTURER_NAME: ABRACON; MANUFACTURER_PART_NUMBER: ABM3-16.000MHZ-B2-T; MOUSER_PART_NUMBER: 815-ABM3-16-B2-T; MOUSER_PRICE-STOCK: https://www.mouser.com/Search/Refine.aspx?Keyword=815-ABM3-16-B2-T
Y2 Y3 = Badge_v202004081200_Eagle_Library_regex:MC-405; DATASHEET: https://support.epson.biz/td/api/doc_check.php?dl=brief_MC-405&lang=en; MANUFACTURER: Epson MC-405 32.7680K-E3: ROHS